# EAGLE board bolek (EAGLE 9.2.1)
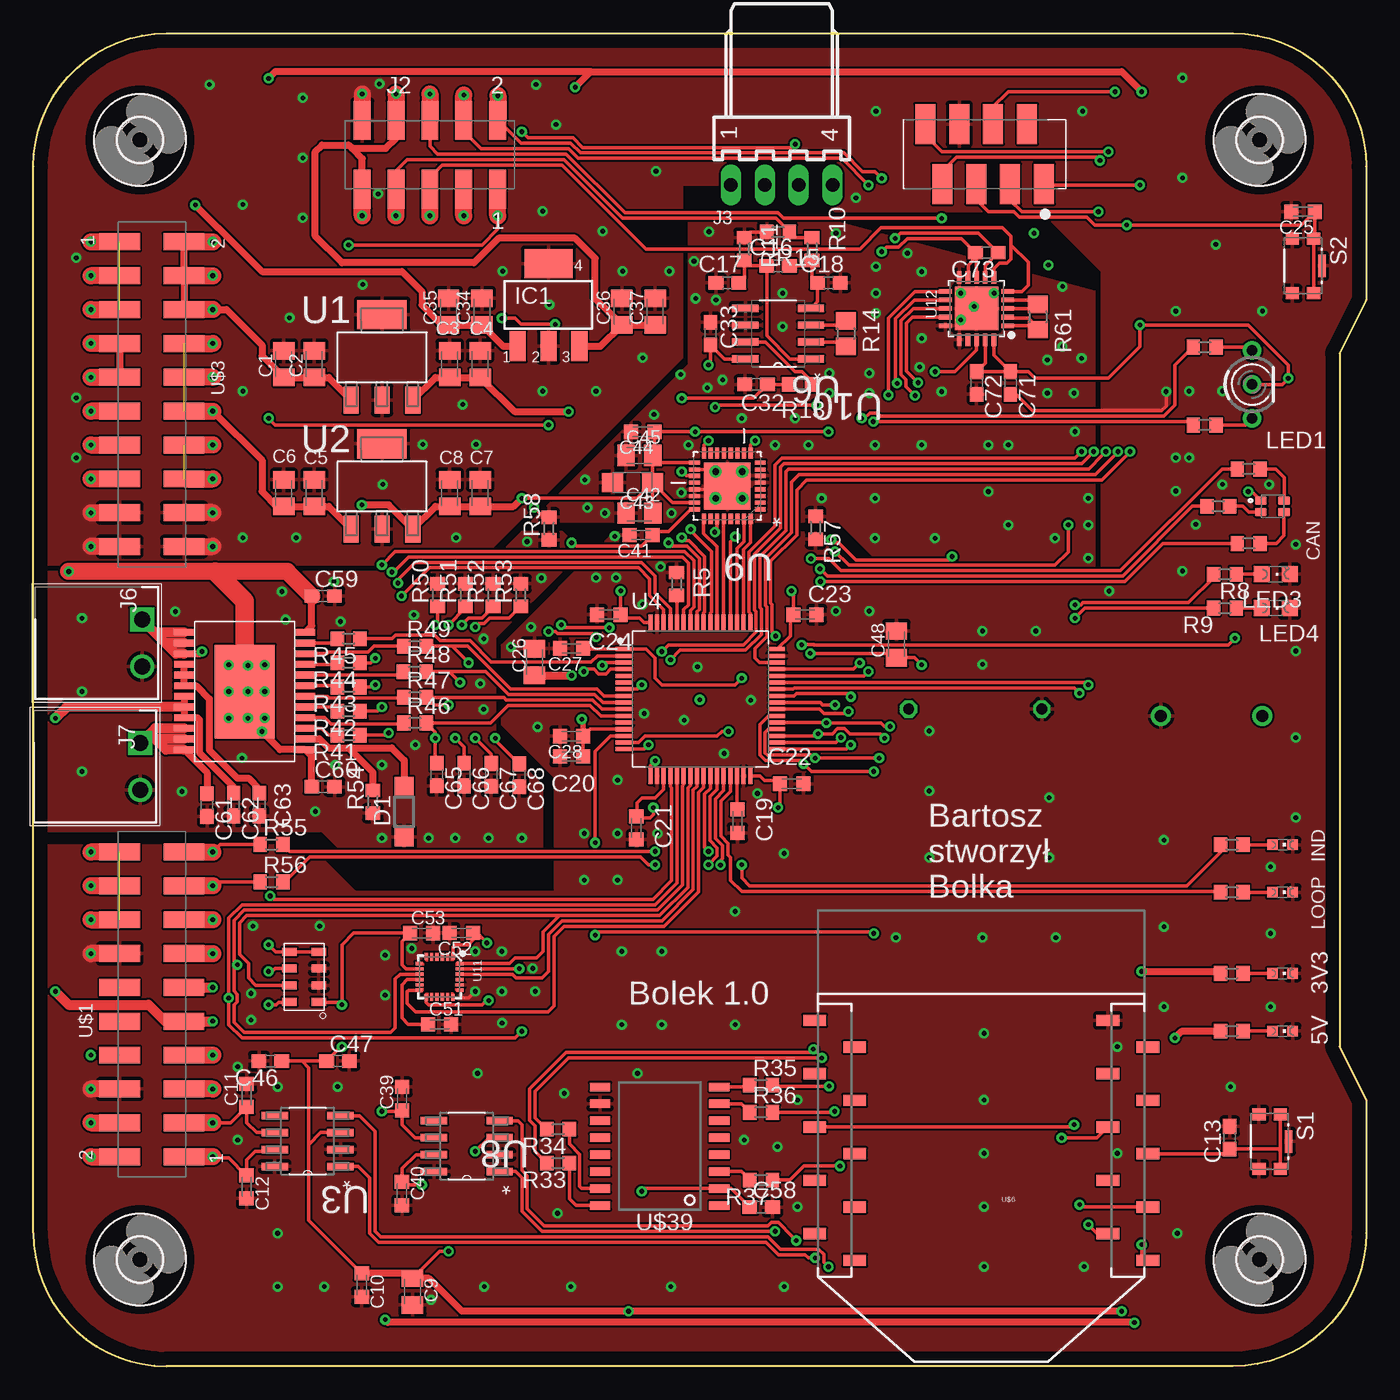
[diagram p10: board, top side]
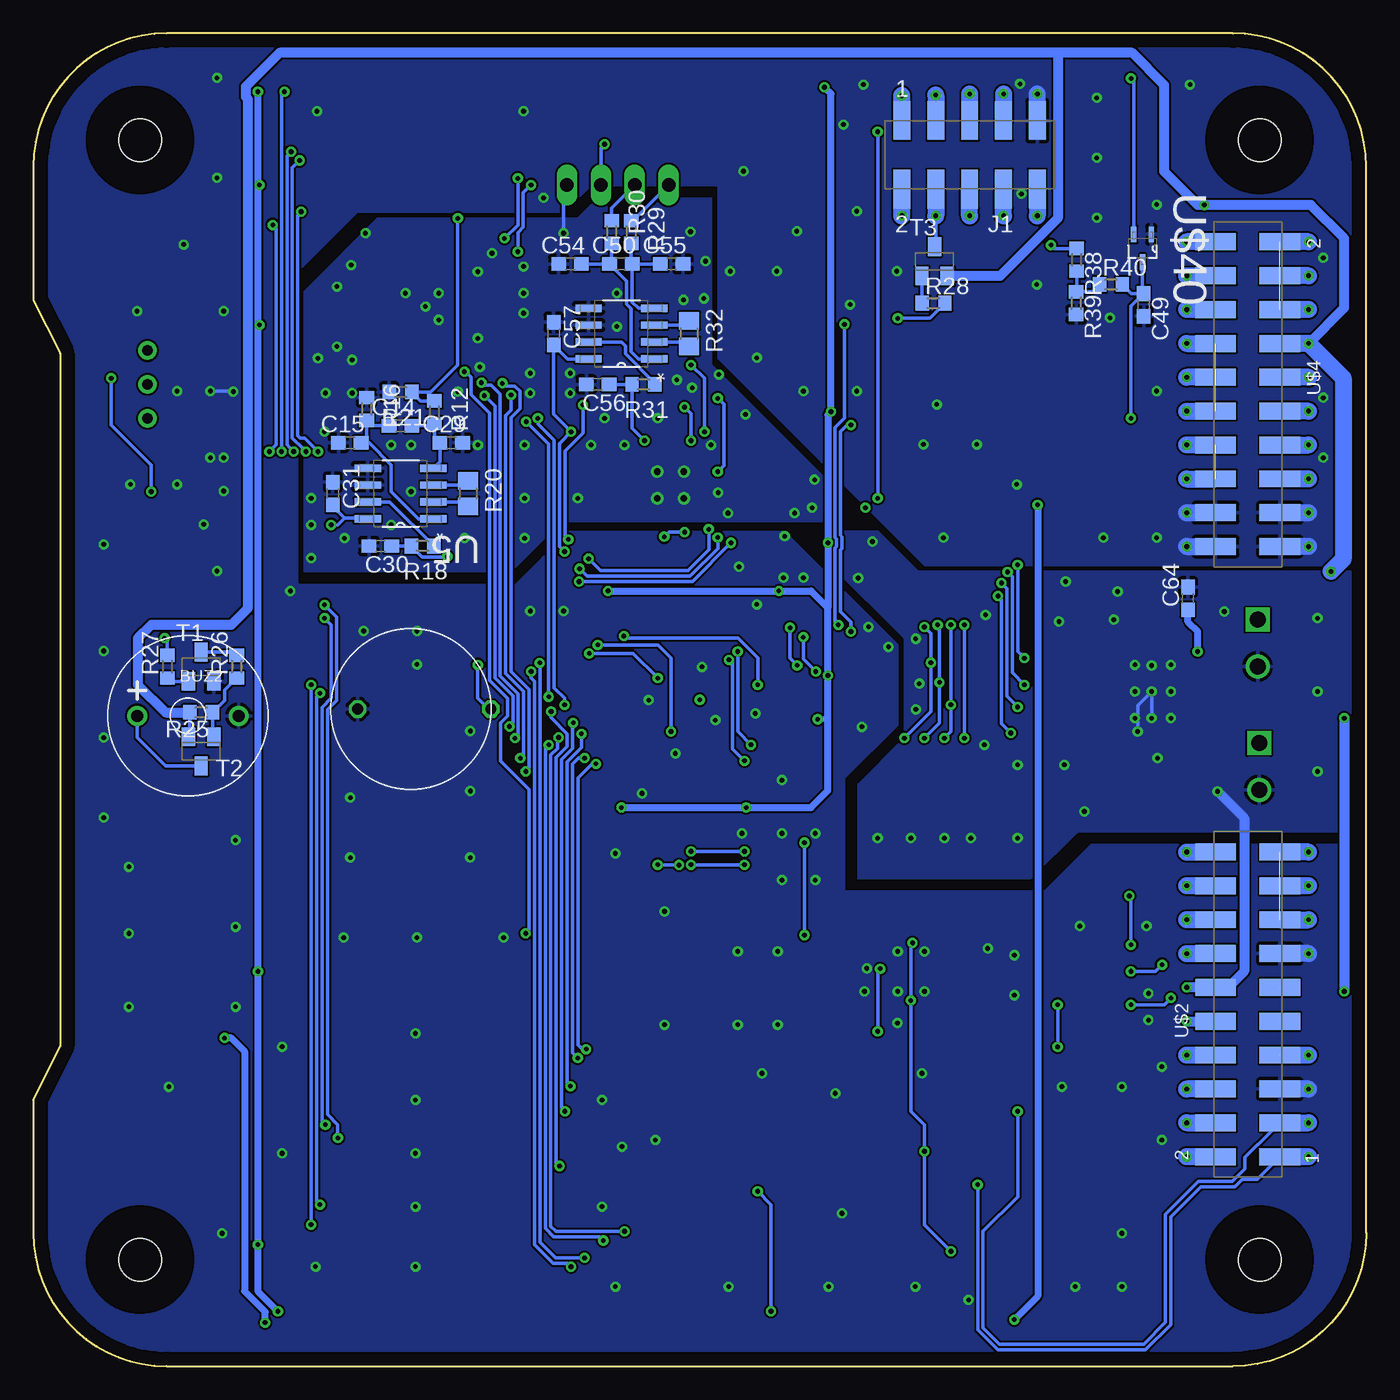
[diagram p11: board, bottom side, seen from below]

Size 100 x 100 mm. Coordinates in mm from the lower left corner, seen from the top.
Outline: 0,10 0,90 arc-90 10,100 90,100 arc-90 100,90 100,80 98,76 98,24 100,20 100,10 arc-90 90,0 10,0 arc-90 0,10
Copper layers (1*16): Top 0.035mm / dielectric 1.5mm / Bottom 0.035mm
Design rules "default": minimum track width 6mil, minimum drill 0.35mm, track to track 6mil, track to pad 6mil, pad to pad 6mil, via to via 6mil, smd to smd 6mil, copper to edge 40mil, drill to drill 6mil, minimum pad ring 10mil, minimum via ring 8mil, stop-mask expansion 4mil, vias tented up to drill 0mil, thermal gap 10mil
tRestrict: area 29.4,28.2 to 31.5,30.3

## Footprints (pad centres in the part's own frame; a part is rotated, then mirrored left to right if it is on the bottom)
CHIPLED_0603 = smd 0.8 x 0.8: A 0,-0.75; C 0,0.75
BZ2-7.6-D12.0XH6.5MM = drill 0.9 pad 1.5: + -3.8,0; - 3.8,0
C0805K = smd 1.3 x 1.6: 1 -1,0; 2 1,0
C0603K = smd 1.05 x 1.08: 1 -0.875,0; 2 0.875,0
C0603 = smd 1.1 x 1: 1 -0.85,0; 2 0.85,0
SMC_A = smd 1.6 x 1.4: + -1.5,0; - 1.5,0
SOD123 = smd 1.4 x 1.4: A 1.9,0; C -1.9,0
LEDSC160X160X070-4N = smd 0.89 x 0.64: 1 -0.87,0.425; 2 0.87,0.425; 3 0.87,-0.425; 4 -0.87,-0.425
3,2 = hole 3.2: 0,0
SOT223 = smd 1.219 x 2.235: 1 -2.311,-3.099; 2 0,-3.099; 3 2.311,-3.099 | smd 3.6 x 2.2: 4 0,3.099
SSM-105-XXX-DV = smd 1.27 x 2.921: 1 5.08,-2.572; 2 5.08,2.572; 3 2.54,-2.572; 4 2.54,2.572; 5 0,-2.572; 6 0,2.572; 7 -2.54,-2.572; 8 -2.54,2.572; 9 -5.08,-2.572; 10 -5.08,2.572
7395-04 = drill 1.016 long: 1 3.81,0; 2 1.27,0; 3 -1.27,0; 4 -3.81,0
SHDR2W100P0X350_1X2_840X920X72 = drill 1.2 pad 1.8 square: 1 0,0 | drill 1.2 pad 1.8: 2 3.5,0
DUOLED-A-3MM = drill 0.8 pad 1.4: 1 -2.54,0; 2 0,0; 3 2.54,0
CHIPLED_0805 = smd 1.2 x 1.2: A 0,-1.05; C 0,1.05
R0603 = smd 1 x 1.1: 1 -0.85,0; 2 0.85,0
R0805 = smd 1.3 x 1.5: 1 -0.95,0; 2 0.95,0
SW_KMR221GLFS = smd 0.9 x 1: 1 -2.05,0.8; 2 -2.05,-0.8; 3 2.05,-0.8; 4 2.05,0.8 | smd 1.7 x 0.55: 5 0,1.425
SOT23-BEC = smd 1 x 1.4: B -0.95,-1.1; C 0,1.1; E 0.95,-1.1
SOT230P700X180-4N = smd 2.032 x 1.143: 1 -3.2,2.311; 2 -3.2,0; 3 -3.2,-2.311 | smd 2.2 x 3.7: 4 3.2,0
SOIC127P600X175-8N = smd 1.981 x 0.559: 1 -2.464,1.905; 2 -2.464,0.635; 3 -2.464,-0.635; 4 -2.464,-1.905; 5 2.464,-1.905; 6 2.464,-0.635; 7 2.464,0.635; 8 2.464,1.905
QFP50P1290X1290X120-64 = smd 0.3 x 1.2: BOOT0 -1.75,5.75; PA3 -3.75,-5.75; PA4 -2.25,-5.75; PA5 -1.75,-5.75; PA6 -1.25,-5.75; PA7 -0.75,-5.75; PA14 3.75,5.75; PA15 3.25,5.75; PB0 0.75,-5.75; PB1 1.25,-5.75; PB2 1.75,-5.75; PB3 0.75,5.75; PB4 0.25,5.75; PB5 -0.25,5.75; PB6 -0.75,5.75; PB7 -1.25,5.75; PB8 -2.25,5.75; PB9 -2.75,5.75; PB10 2.25,-5.75; PC4 -0.25,-5.75; PC5 0.25,-5.75; PC10 2.75,5.75; PC11 2.25,5.75; PC12 1.75,5.75; PD2 1.25,5.75; VCAP_1 2.75,-5.75; VDD_1 3.75,-5.75; VDD_3 -3.75,5.75; VDD_4 -2.75,-5.75; VSS_1 3.25,-5.75; VSS_3 -3.25,5.75; VSS_4 -3.25,-5.75 | smd 1.2 x 0.3: NRST -5.75,0.75; PA0 -5.75,-2.75; PA1 -5.75,-3.25; PA2 -5.75,-3.75; PA8 5.75,0.25; PA9 5.75,0.75; PA10 5.75,1.25; PA11 5.75,1.75; PA12 5.75,2.25; PA13 5.75,2.75; PB12 5.75,-3.75; PB13 5.75,-3.25; PB14 5.75,-2.75; PB15 5.75,-2.25; PC0 -5.75,0.25; PC1 -5.75,-0.25; PC2 -5.75,-0.75; PC3 -5.75,-1.25; PC6 5.75,-1.75; PC7 5.75,-1.25; PC8 5.75,-0.75; PC9 5.75,-0.25; PC13 -5.75,3.25; PC14-OSC32_IN -5.75,2.75; PC15-OSC32_OUT -5.75,2.25; PH0-OSC_IN -5.75,1.75; PH1-OSC_OUT -5.75,1.25; VBAT -5.75,3.75; VDD_2 5.75,3.75; VSS_2 5.75,3.25; VSSA/VREF- -5.75,-1.75 | smd 1.2 x 0.328: VDDA/VREF+ -5.75,-2.25
QFN50P500X500X80-33N = smd 0.813 x 0.305: 1 -2.464,1.753; 2 -2.464,1.245; 3 -2.464,0.762; 4 -2.464,0.254; 5 -2.464,-0.254; 6 -2.464,-0.762; 7 -2.464,-1.245; 8 -2.464,-1.753; 17 2.464,-1.753; 18 2.464,-1.245; 19 2.464,-0.762; 20 2.464,-0.254; 21 2.464,0.254; 22 2.464,0.762; 23 2.464,1.245; 24 2.464,1.753 | smd 0.305 x 0.813: 9 -1.753,-2.464; 10 -1.245,-2.464; 11 -0.762,-2.464; 12 -0.254,-2.464; 13 0.254,-2.464; 14 0.762,-2.464; 15 1.245,-2.464; 16 1.753,-2.464; 25 1.753,2.464; 26 1.245,2.464; 27 0.762,2.464; 28 0.254,2.464; 29 -0.254,2.464; 30 -0.762,2.464; 31 -1.245,2.464; 32 -1.753,2.464 | smd 3.505 x 3.505: 33 0,0
MPU-9250 = smd 0.495 x 0.25: 1 -1.552,1; 6 -1.552,-1; 13 1.552,-1; 18 1.552,1 | smd 0.6 x 0.25: 2 -1.5,0.6; 3 -1.5,0.2; 4 -1.5,-0.2; 5 -1.5,-0.6; 14 1.5,-0.6; 15 1.5,-0.2; 16 1.5,0.2; 17 1.5,0.6 | smd 0.25 x 0.495: 7 -1,-1.552; 12 1,-1.552; 19 1,1.552; 24 -1,1.552 | smd 0.25 x 0.6: 8 -0.6,-1.5; 9 -0.2,-1.5; 10 0.2,-1.5; 11 0.6,-1.5; 20 0.6,1.5; 21 0.2,1.5; 22 -0.2,1.5; 23 -0.6,1.5
QFN20_4MM_0.65MM = smd 0.35 x 0.95: 1 -1.3,-2.34; 2 -0.65,-2.34; 3 0,-2.34; 4 0.65,-2.34; 5 1.3,-2.34; 11 1.3,2.34; 12 0.65,2.34; 13 0,2.34; 14 -0.65,2.34; 15 -1.3,2.34 | smd 0.95 x 0.35: 6 2.34,-1.3; 7 2.34,-0.65; 8 2.34,0; 9 2.34,0.65; 10 2.34,1.3; 16 -2.34,1.3; 17 -2.34,0.65; 18 -2.34,0; 19 -2.34,-0.65; 20 -2.34,-1.3 | smd 3.25 x 3.25: PAD 0,0
IPT1-110-01-X-D-VS = smd 1.27 x 3.048: 1 -11.43,-2.413; 2 -11.43,2.413; 3 -8.89,-2.413; 4 -8.89,2.413; 5 -6.35,-2.413; 6 -6.35,2.413; 7 -3.81,-2.413; 8 -3.81,2.413; 9 -1.27,-2.413; 10 -1.27,2.413; 11 1.27,-2.413; 12 1.27,2.413; 13 3.81,-2.413; 14 3.81,2.413; 15 6.35,-2.413; 16 6.35,2.413; 17 8.89,-2.413; 18 8.89,2.413; 19 11.43,-2.413; 20 11.43,2.413
MICROMATCH_8 = smd 1.5 x 3: 1 -5.715,2.25; 2 -4.445,-2.25; 3 -3.175,2.25; 4 -1.905,-2.25; 5 -0.635,2.25; 6 0.635,-2.25; 7 1.905,2.25; 8 3.175,-2.25
XBEE-SMD = smd 1.7 x 0.85: 1 -12.5,20; 2 -9.5,18; 3 -12.5,16; 4 -9.5,14; 5 -12.5,12; 6 -9.5,10; 7 -12.5,8; 8 -9.5,6; 9 -12.5,4; 10 -9.5,2; 11 12.5,2; 12 9.5,4; 13 12.5,6; 14 9.5,8; 15 12.5,10; 16 9.5,12; 17 12.5,14; 18 9.5,16; 19 12.5,18; 20 9.5,20
MS56XX = smd 1.1 x 0.6: P$1 -1.1,1.875; P$2 -1.1,0.625; P$3 -1.1,-0.625; P$4 -1.1,-1.875; P$5 1.1,-1.875; P$6 1.1,-0.625; P$7 1.1,0.625; P$8 1.1,1.875
CR1220_POZ = drill 0.8 octagon: + 6,0; GND -4,0
SOIC16 = smd 0.635 x 1.524: 1 -4.445,-4.469; 2 -3.175,-4.469; 3 -1.905,-4.469; 4 -0.635,-4.469; 5 0.635,-4.469; 6 1.905,-4.469; 7 3.175,-4.469; 8 4.445,-4.469; 9 4.445,4.469; 10 3.175,4.469; 11 1.905,4.469; 12 0.635,4.469; 13 -0.635,4.469; 14 -1.905,4.469; 15 -3.175,4.469; 16 -4.445,4.469
SOT65P210X110-3N = smd 1.168 x 0.406: 1 -1.041,0.66; 2 -1.041,-0.66; 3 1.041,0
POWERSSO-24 = smd 1.5 x 0.5: P$1 -0.8,9.6; P$2 -0.8,8.8; P$3 -0.8,8; P$4 -0.8,7.2; P$5 -0.8,6.4; P$6 -0.8,5.6; P$7 -0.8,4.8; P$8 -0.8,4; P$9 -0.8,3.2; P$10 -0.8,2.4; P$11 -0.8,1.6; P$12 -0.8,0.8; P$13 8.3,9.6; P$14 8.3,8.8; P$15 8.3,8; P$16 8.3,7.2; P$17 8.3,6.4; P$18 8.3,5.6; P$19 8.3,4.8; P$20 8.3,4; P$21 8.3,3.2; P$22 8.3,2.4; P$23 8.3,1.6; P$24 8.3,0.8 | smd 4.5 x 7: P$25 3.733,5.253

## Placement (x,y rotation side)
3V3  [CHIPLED_0603]  93.73,29.46 270 top
5V  [CHIPLED_0603]  93.73,25.15 270 top
BUZ2  KS-12065D03YA  [BZ2-7.6-D12.0XH6.5MM]  88.41,48.8 0 bottom
C1  10u  [C0805K]  18.8,75.18 90 top
C2  [C0805K]  21.08,75.18 90 top
C3  10u  [C0805K]  31.24,75.18 90 top
C4  2u2  [C0805K]  33.53,75.18 90 top
C5  10u  [C0805K]  21.08,65.5 90 top
C6  [C0805K]  18.8,65.5 90 top
C7  10u  [C0805K]  33.53,65.5 90 top
C8  2u2  [C0805K]  31.24,65.5 90 top
C9  10u  [C0805K]  28.45,5.59 270 top
C10  100n  [C0603K]  24.64,6.1 270 top
C11  100p  [C0603K]  16,20.32 90 top
C12  100p  [C0603K]  16,13.45 270 top
C13  100nf  [C0603]  89.76,17.14 90 top
C14  10nf  [C0603]  72.45,70.55 0 bottom
C15  1nf  [C0603]  76.26,69.28 0 bottom
C16  10nf  [C0603]  55.88,82.55 0 top
C17  1nf  [C0603]  52.07,81.28 0 top
C18  1nf  [C0603]  59.69,81.28 0 top
C19  2.2uF  [C0603K]  52.83,40.89 270 top
C20  100nF  [C0603K]  40.39,45.74 180 top
C21  100nF  [C0603K]  45.24,40.39 270 top
C22  100nF  [C0603K]  56.9,43.69 0 top
C23  100nF  [C0603K]  57.9,56.39 0 top
C24  100nF  [C0603K]  43.18,56.39 180 top
C25  100nF  [C0603K]  95.25,86.61 180 top
C26  10uF  [C0805K]  37.59,52.83 90 top
C27  100nF  [C0603K]  40.39,53.85 180 top
C28  1u  [C0603K]  40.39,47.27 180 top
C29  1nf  [C0603]  68.64,69.28 0 bottom
C30  10nf  [C0603]  73.97,61.53 180 bottom
C31  0.1uf  [C0603]  77.53,65.47 270 bottom
C32  10nf  [C0603]  54.23,73.66 180 top
C33  0.1uf  [C0603]  50.8,77.47 270 top
C34  10u  [C0805K]  33.65,79.12 90 top
C35  [C0805K]  31.15,79.12 90 top
C36  10u  [C0805K]  44.15,79.12 90 top
C37  2u2  [C0805K]  46.65,79.12 90 top
C39  100p  [C0603K]  27.67,20.07 90 top
C40  100p  [C0603K]  27.66,12.95 270 top
C41  100nf  [C0603K]  45.59,62.36 180 top
C42  10u  [C0805K]  45.47,64.01 0 top
C43  [SMC_A]  44.96,66.29 180 top
C44  100nf  [C0603K]  45.72,70.1 180 top
C45  10u  [C0805K]  45.47,68.33 0 top
C46  [C0603]  17.78,22.9 180 top
C47  [C0603]  22.86,22.9 0 top
C48  100nf  [C0805K]  64.76,54.15 90 top
C49  100nf  [C0603]  16.7,79.62 270 bottom
C50  10nf  [C0603]  55.92,82.69 0 bottom
C51  H100n  [C0603K]  30.48,25.65 0 top
C52  H10n  [C0603K]  32.12,32.5 180 top
C53  H100n  [C0603K]  29.13,32.49 0 top
C54  1nf  [C0603]  59.73,82.69 0 bottom
C55  1nf  [C0603]  52.11,82.69 0 bottom
C56  10nf  [C0603]  57.66,73.66 180 bottom
C57  0.1uf  [C0603]  60.96,77.47 270 bottom
C58  100nf  [C0603]  54.61,11.93 0 top
C59  100nf  [C0603]  21.74,57.78 0 top
C60  100nf  [C0603]  21.74,43.47 0 top
C61  10nf  [C0603]  13.03,42.1 270 top
C62  10nf  [C0603]  15.03,42.13 270 top
C63  10nf  [C0603]  16.95,42.13 270 top
C64  10nf  [C0603]  13.37,57.61 90 bottom
C65  10nf  [C0603]  30.27,44.39 270 top
C66  10nf  [C0603]  32.32,44.38 270 top
C67  10nf  [C0603]  34.35,44.37 270 top
C68  10nf  [C0603]  36.45,44.34 270 top
C71  0.1uf  [C0603]  73.31,73.77 270 top
C72  0.1uf  [C0603]  70.77,73.77 270 top
C73  10nf  [C0603]  71.53,83.55 180 top
D1  [SOD123]  27.82,41.61 90 top
D2  APTF1616LSEEZGKQBKC  [LEDSC160X160X070-4N]  92.96,64.52 0 top
H1  MOUNT-HOLE3.2  [3,2]  8,92 0 top
H2  MOUNT-HOLE3.2  [3,2]  8,8 0 top
H3  MOUNT-HOLE3.2  [3,2]  92,8 0 top
H4  MOUNT-HOLE3.2  [3,2]  92,92 0 top
IC1  TLE4266GSV10  [SOT223]  38.65,79.62 0 top
IND  [CHIPLED_0603]  93.73,39.12 270 top
J1  SSM-105-XXX-DV  [SSM-105-XXX-DV]  29.75,90.89 180 bottom
J2  SSM-105-XXX-DV  [SSM-105-XXX-DV]  29.75,90.89 0 top
J3  22-05-7048-04  [7395-04]  56.15,88.62 180 top
J6  1844210  [SHDR2W100P0X350_1X2_840X920X72]  8.15,56 270 top
J7  1844210  [SHDR2W100P0X350_1X2_840X920X72]  8.02,46.75 270 top
LED1  L-115WEGW-CA  [DUOLED-A-3MM]  91.44,73.66 270 top
LED3  LEDCHIPLED_0805  [CHIPLED_0805]  93.21,59.42 270 top
LED4  LEDCHIPLED_0805  [CHIPLED_0805]  93.21,56.88 270 top
LOOP  [CHIPLED_0603]  93.73,35.56 270 top
R1  [R0603]  89.92,29.46 0 top
R2  [R0603]  89.92,25.15 0 top
R3  [R0603]  89.92,35.56 0 top
R4  470  [R0603]  87.88,70.61 180 top
R5  [R0603]  48.26,58.69 270 top
R6  470  [R0603]  87.88,76.45 180 top
R7  [R0603]  89.92,39.12 0 top
R8  470  [R0603]  89.4,59.42 180 top
R9  470  [R0603]  89.4,56.88 0 top
R10  4.02k  [R0603]  58.42,83.82 270 top
R11  4.02k  [R0603]  53.34,83.82 270 top
R12  4.02k  [R0603]  69.91,71.57 270 bottom
R13  4.02k  [R0603]  57.53,73.66 180 top
R14  0  [R0805]  60.96,77.47 270 top
R15  10  [R0603]  55.88,85.09 180 top
R16  4.02k  [R0603]  74.99,71.82 270 bottom
R18  4.02k  [R0603]  70.8,61.53 180 bottom
R20  0  [R0805]  67.37,65.47 270 bottom
R21  10  [R0603]  72.45,73.09 180 bottom
R25  10k  [R0603]  87.41,49.05 180 bottom
R26  10k  [R0603]  84.74,52.48 90 bottom
R27  10k  [R0603]  89.95,52.48 90 bottom
R28  10k  [R0603]  32.45,79.76 0 bottom
R29  4.02k  [R0603]  55.15,85.09 270 bottom
R30  4.02k  [R0603]  56.61,85.09 270 bottom
R31  4.02k  [R0603]  54.23,73.66 180 bottom
R32  0  [R0805]  50.8,77.47 270 bottom
R33  10  [R0603]  39.37,15.24 180 top
R34  10  [R0603]  39.37,17.78 180 top
R35  10  [R0603]  54.61,21.09 0 top
R36  10  [R0603]  54.61,19.05 0 top
R37  10  [R0603]  54.61,13.97 180 top
R38  100k  [R0603]  21.72,83 270 bottom
R39  10k  [R0603]  21.76,79.76 270 bottom
R40  10k  [R0603]  19.15,81.15 0 bottom
R41  10k  [R0603]  23.66,47.34 180 top
R42  10k  [R0603]  23.66,49.15 180 top
R43  10k  [R0603]  23.66,50.96 180 top
R44  10k  [R0603]  23.66,52.77 180 top
R45  10k  [R0603]  23.66,54.58 180 top
R46  10k  [R0603]  28.64,48.26 0 top
R47  10k  [R0603]  28.64,50.18 0 top
R48  10k  [R0603]  28.62,52.11 0 top
R49  10k  [R0603]  28.64,54.02 0 top
R50  1k  [R0603]  30.33,57.86 90 top
R51  1k  [R0603]  32.41,57.86 90 top
R52  1k  [R0603]  34.49,57.86 90 top
R53  1k  [R0603]  36.57,57.86 90 top
R54  1k  [R0603]  25.47,42.34 90 top
R55  1k  [R0603]  17.87,39.14 0 top
R56  1k  [R0603]  17.87,36.33 0 top
R57  0  [R0603]  58.69,62.9 270 top
R58  0  [R0603]  38.69,62.84 90 top
R61  [R0805]  75.37,78.72 270 top
R106  470  [R0603]  91.19,67.31 180 top
R107  470  [R0603]  91.19,61.72 180 top
R108  470  [R0603]  88.9,64.52 180 top
S1  KMR221GLFS  [SW_KMR221GLFS]  92.76,16.86 270 top
S2  KMR221GLFS  [SW_KMR221GLFS]  95.25,82.55 270 top
T1  [SOT23-BEC]  87.41,52.48 0 bottom
T2  [SOT23-BEC]  87.41,46.13 180 bottom
T3  [SOT23-BEC]  32.38,82.89 0 bottom
U1  MCP1826S-5002E/DB  [SOT230P700X180-4N]  26.16,75.69 90 top
U2  MCP1826S-5002E/DB  [SOT230P700X180-4N]  26.16,66.01 90 top
U3  SN65HVD230DR  [SOIC127P600X175-8N]  20.57,16.89 180 top
U4  STM32F446RCT6LQFP64  [QFP50P1290X1290X120-64]  50.04,50.04 0 top
U5  AD8227BRZ-R7  [SOIC127P600X175-8N]  72.45,65.47 180 bottom
U6  AD8227BRZ-R7  [SOIC127P600X175-8N]  55.88,77.47 180 top
U8  SN65HVD230DR  [SOIC127P600X175-8N]  32.52,16.51 180 top
U9  AD7194BCPZ  [QFN50P500X500X80-33N]  52.07,66.04 180 top
U10  AD8227BRZ-R7  [SOIC127P600X175-8N]  55.88,77.47 180 bottom
U11  MPU-9250  [MPU-9250]  30.48,29.21 270 top
U12  MAX31865  [QFN20_4MM_0.65MM]  70.77,79.35 90 top
U$1  IPT1-110-01-X-D-VS  [IPT1-110-01-X-D-VS]  8.89,27.15 90 top
U$2  IPT1-110-01-X-D-VS  [IPT1-110-01-X-D-VS]  8.89,27.15 90 bottom
U$3  IPT1-110-01-X-D-VS  [IPT1-110-01-X-D-VS]  8.89,72.92 270 top
U$4  IPT1-110-01-X-D-VS  [IPT1-110-01-X-D-VS]  8.89,72.92 270 bottom
U$5  MICROMATCH_8  [MICROMATCH_8]  70.1,90.93 180 top
U$6  XBEE-1B3  [XBEE-SMD]  71.12,27.94 180 top
U$31  MS56XX  [MS56XX]  20.32,29.21 180 top
U$32  CR1220_POZ  [CR1220_POZ]  71.67,49.3 0 bottom
U$39  S25FLX  [SOIC16]  46.99,16.51 90 top
U$40  BAS40W-04  [SOT65P210X110-3N]  16.78,83.87 270 bottom
VNQ5027AK-E1  VNQ5027AK-E  [POWERSSO-24]  19.6,55.86 180 top

## Tracks (layer width: path | path; a pad name or v marks a point on that pad's centre or on a via)
3V8  (via drill 0.35)
  Top 0.508: v13.46,79.27 14.5,79.27 17.15,76.62 17.15,75.81 17.83,75.13 17.85,75.13 C1.1 C2.1 22.16,74.18 U1.1 | U$4.1 U$4.3 U$4.5
  Top 1.27: U$4.1 v13.46,84.35 | U$4.3 v13.46,81.81 | v13.46,79.27 U$4.5
  Bottom 1.27: U$4.1 v13.46,84.35 | v13.46,81.81 U$4.3 | U$4.5 v13.46,79.27
5V5  (via drill 0.35)  (2 unrouted)
  Top 0.508: v13.46,71.65 17.15,67.97 17.15,65.62 18.27,64.5 C6.1 C5.1 22.16,64.5 U2.1
  Top 1.27: U$4.7 v13.46,76.73 | v13.46,74.19 U$4.9 | U$4.11 v13.46,71.65
  Bottom 1.27: v13.46,76.73 U$4.7 | U$4.9 v13.46,74.19 | v13.46,71.65 U$4.11
6V6  (via drill 0.35)  (1 unrouted)
  Top 1.27: v13.46,69.11 U$4.13 | U$4.15 v13.46,66.57
  Bottom 1.27: U$4.13 v13.46,69.11 | v13.46,66.57 U$4.15
7V4  (via drill 0.35)  (2 unrouted)
  Top 1.27: v4.32,84.35 U$3.1 | U$3.3 v4.32,81.81 | v4.32,79.27 U$3.5
  Bottom 1.27: v4.32,84.35 U$3.1 | v4.32,81.81 U$3.3 | v4.32,79.27 U$3.5
+3V3  (via drill 0.35)
  Top 0.152: 53.8,44.28 U4.VDD_1
  Top 0.254: U4.VDD_2 56.79,54.79 56.79,56.15 C23.1 57.02,58.02 v56.88,58.17 | U4.VDD_3 45.81,55.79 45.47,56.13 44.31,56.13 C24.1 44.05,58.15 v44.07,58.17 | U4.VDD_1 54.52,44.29 54.86,43.94 55.77,43.94 C22.1 56.02,42.05 v55.88,41.91 | C20.1 C28.1 41.78,47.79 U4.VDDA/VREF+ | v46.51,41.91 46.51,41.4 46.26,41.15 45.36,41.15 C21.1 45.29,41.3 45.29,42.26 45.65,42.62 46.65,42.62 47.29,43.26 U4.VDD_4 | v40.39,61.78 40.49,61.78 40.74,61.53 45.64,61.53 C41.1 46.73,62.62 47.65,62.62 49.32,64.29 U9.24 | C46.1 20.15,22.9 | 20.15,22.9 C47.1 23.07,23.96 v23.15,23.96 | U$31.P$1 21.45,27.3 22.97,27.3 v23.15,27.12 23.15,31.62 24.02,32.49 C53.1 27.65,31.89 27.65,30.12 27.95,29.82 U11.8 | U11.13 29.48,27.29 29.65,27.12 33.65,27.12 33.96,27.43 v34.16,27.43 | C58.1 52.35,13.34 U$39.2 45.87,13.34 v45.65,13.12 | C10.1 20.65,10.96 20.65,16.62 | 20.65,16.62 21.56,17.53 U3.3 | 20.15,22.9 20.65,22.4 20.65,16.62 | C9.1 30.48,8.62 v31.15,8.62 | v33.15,16.12 34.17,17.14 U8.3 | v83.03,88.62 75.88,88.62 U$5.1 | v83.15,9.12 83.15,8.41 U$6.1 | LED1.2 93.69,73.66 v94.15,74.12 94.15,75.12 91.15,78.12 v83.03,78.12 83.03,76.5 80.65,74.12 75.15,74.12 74.65,74.62 C71.1 | D2.1 91.42,65.62 v91.15,65.62 | v34.04,31.76 33.29,32.5 C52.1 33,31.97 32.65,31.62 31.65,31.62 31.48,31.45 U11.1 | U12.19 71.42,75.27 C72.1 C71.1 | C71.1 72.07,75.86 U12.20
  Top 0.406: C28.1 41.26,48.42 v41.15,48.54
  Top 0.508: U1.3 30.17,74.18 C3.1 C4.1 36.09,71.62 v40.15,71.62 | v40.65,95.96 41.81,97.12 | v83.15,95.62 81.65,97.12 41.81,97.12 | v81.65,4.12 v44.65,4.12 32.15,4.12 29.68,6.59 C9.1 28.06,6.97 C10.1 | 41.81,97.12 18.15,97.12 v17.65,96.62 | v83.15,29.62 88.91,29.62 R1.1
  Top 0.61: C26.1 40.37,51.83 v40.39,51.82
  Bottom 0.254: v23.15,23.96 v23.15,27.12 | v34.04,31.76 34.16,31.63 v34.16,27.43 34.16,19.13 33.15,18.12 v33.15,16.12 33.15,10.62 v31.15,8.62 | v17.65,96.62 17.44,96.41 U$40.2 | 83.15,88.62 v83.03,88.62 | v44.65,4.12 44.65,12.12 v45.65,13.12 | 83.15,78.62 83.15,78.24 v83.03,78.12 | v91.15,65.62 91.15,67.62 94.15,70.62 v94.15,74.12
  Bottom 0.406: v41.15,48.54 40.39,48.54
  Bottom 0.508: v56.88,58.17 v44.07,58.17 41.66,58.17 40.39,56.9 | v55.88,41.91 v46.51,41.91 41.66,41.91 40.39,43.18 40.39,48.54 v40.39,51.82 40.39,56.9 | 40.39,56.9 v40.39,61.78 40.39,71.38 v40.15,71.62 40.15,95.46 v40.65,95.96 | v81.65,4.12 83.15,5.62 v83.15,9.12 v83.15,29.62 83.15,78.62 83.15,88.62 v83.15,95.62
+5V  (via drill 0.35)
  Top 0.254: v36.65,65.12 45.28,65.12 C43.+ | C45.2 46.59,68.45 C44.1 v49.65,70.1 v59.65,70.1 | C45.2 46.47,66.3 C43.+ | C43.+ C42.2 | C45.2 47,67.79 U9.17 | C43.+ 47.96,64.8 U9.23 | v50.65,75.12 50.8,75.27 C33.2 51.85,75.56 U6.8 | v36.65,92.62 37.12,92.15 40.49,92.15 41.21,91.43 56.9,91.43 v57.15,91.68 | v60.15,61.12 61.18,60.09 76.65,60.09 77.65,61.09 v77.65,63.12
  Top 0.508: v36.65,65.12 36.03,64.5 C7.1 C8.1 30.17,64.5 U2.3 26.66,64.62 v24.65,64.62 | v26.4,3.49 26.61,3.29 82.59,3.29 v82.6,3.27 | v85.65,24.62 86.18,25.15 R2.1
  Bottom 0.254: v36.65,65.12 v36.65,92.62 | v49.65,70.1 49.65,74.12 v50.65,75.12 | U10.8 59.9,75.56 C57.2 60.96,71.41 v59.65,70.1 60.52,69.23 60.52,61.49 v60.15,61.12 | v57.15,91.68 57.42,91.41 J3.3 | U5.8 74.97,63.62 76.65,63.62 | 76.65,63.62 77.53,64.5 C31.2 | v77.65,63.12 77.15,63.12 76.65,63.62
  Bottom 0.508: v24.65,64.62 24.65,5.25 v26.4,3.49 | v82.6,3.27 82.6,4.07 84.15,5.62 84.15,23.62 85.15,24.62 v85.65,24.62
ADC_CS
  Top 0.254: U4.PA15 53.29,61.26 53.82,61.79 U9.32
ADC_MISO  (via drill 0.35)
  Top 0.254: U9.27 51.31,62.75 v51.13,62.58 | v52.66,62.23 52.29,61.85 U4.PC11
  Bottom 0.254: v51.13,62.58 52.32,62.58 v52.66,62.23
ADC_MOSI
  Top 0.254: U4.PC12 51.79,63.55 U9.28
ADC_POWER1_CURRENT  (via drill 0.35)
  Top 0.254: U4.PC3 42.58,48.79 41.79,49.58 35.61,49.58 34.29,48.26 R46.2 30.15,47.6 v30.15,47.12 30.15,45.36 C65.1 | v30.15,55.62 30.33,55.8 R50.1
  Bottom 0.254: v30.15,47.12 v30.15,55.62
ADC_POWER2_CURRENT  (via drill 0.35)
  Top 0.254: U4.PC2 42.65,49.29 41.95,49.99 35.48,49.99 35.3,50.16 29.51,50.16 R47.2 30.05,49.62 v31.15,49.62 | v31.65,47.12 32.32,46.45 C66.1 | v31.15,55.62 32.41,56.88 R51.1
  Bottom 0.254: v31.65,47.12 31.15,47.62 v31.15,49.62 v31.15,55.62
ADC_POWER3_CURRENT  (via drill 0.35)
  Top 0.254: U4.PC1 42.73,49.79 42.12,50.39 35.65,50.39 33.92,52.12 29.49,52.12 R48.2 31.2,52.11 v32,51.31 | v33.15,47.12 34.35,45.91 C67.1 | v32.15,55.62 32.65,56.12 33.65,56.12 34.49,56.96 R52.1
  Bottom 0.254: v33.15,47.12 32,48.27 v32,51.31 32,55.47 v32.15,55.62
ADC_POWER4_CURRENT  (via drill 0.35)
  Top 0.254: U4.PC0 42.8,50.29 42.29,50.8 35.81,50.8 32.59,54.02 R49.2 31.42,54.02 v32.66,52.78 | C68.1 34.65,46.99 v34.65,47.12 | v33.15,55.46 33.4,55.71 33.82,55.71 34.23,56.12 35.68,56.12 R53.1
  Bottom 0.254: v34.65,47.12 32.66,49.11 v32.66,52.78 32.66,54.97 v33.15,55.46
ADC_SCLK
  Top 0.254: U4.PC10 52.79,61.33 53.32,61.87 53.32,63.57 U9.31
ADC_SYNC
  Top 0.254: U4.PD2 51.29,61.49 50.29,62.48 50.29,63.55 U9.25
AGND  (via drill 0.35, 0.5)
  Top 0.254: U9.18 50.48,67.28 50.65,67.12 50.65,66.12 | 50.65,66.12 50.42,65.89 50.42,65.79 U9.21 | U9.33 50.73,66.04 50.65,66.12 | U12.PAD 70.73,79.35 v70.58,79.5 | R58.2 38.28,63.69 v37.57,64.4 | R15.2 53.76,85.09 R11.1
  Bottom 0.254: v60.22,85 60.22,88.36 J3.4
  other vias: 59.15,65.12 78.15,70.12 66.65,69.12 63.15,69.12 58.15,69.12 55.65,69.12 49.15,69.12 53.15,71.12 57.15,71.12 47.88,64.01 48.62,65.55 42.88,64.01 41.38,66.51 41.57,64.4 50.57,73.4 46.57,71.4 48.57,74.4 49.57,82.9 51.19,67.11 49.69,80.11 50.69,85.11 51.22,80 56.22,78 56.22,80.5 75.08,85 63.22,82.5 63.22,80.5 63.22,79 62.72,74.5 62.72,73 59.72,73 59.72,74.5 51.72,74 76.08,73 69.58,78.5 69.58,80.5 65.58,83.5 77.22,81 77.22,76.5 53.19,67.11 51.19,65.11 53.19,65.11 63.15,65.12 79.15,65.12 63.15,62.12 79.15,60.62 76.15,82.62 66.5,74.97 72.08,80.5 76.08,75.5 78.08,73 71.65,69.12 73.15,69.12 71.65,65.62 67.65,62.12 76.65,62.12 78.65,75.62 73.15,63.12 79.15,63.12 68.15,73.12 66.65,77.12 66.65,82.12
  pour Top: 37.4,63.37 60.4,63.37 64.15,59.62 79.65,59.62 79.65,80.62 59.15,86.12 57.65,87.62 49.15,87.62 49.15,75.13
  pour Bottom: 37.4,63.37 60.4,63.37 64.15,59.62 79.65,59.62 79.65,80.62 74.15,86.12 59.15,86.12 57.65,87.62 49.15,87.62 49.15,75.13
BACKUP_SUPPLY  (via drill 0.35)  (2 unrouted)
  Top 1.27: v4.32,33.5 U$2.15 | U$2.17 v4.32,36.04 | U$2.19 v4.32,38.58
  Bottom 1.27: U$2.15 v4.32,33.5 | v4.32,36.04 U$2.17 | v4.32,38.58 U$2.19
BURNOUT_PIN_IN  (via drill 0.35)
  Top 0.254: v17.65,71.12 18.15,70.62 v38.65,70.62 | v38.65,55.12 39.17,55.12 39.33,54.96 41.96,54.96 v42.23,54.7 | v41.3,52.12 41.46,52.29 42.05,52.29 42.41,51.92 42.96,51.92 43.32,52.29 U4.PC15-OSC32_OUT
  Bottom 0.254: C49.1 16.78,80.55 U$40.3 | R40.2 17.62,80.47 C49.1 | C49.1 17.65,79.52 v17.65,71.12 | v38.65,70.62 38.95,70.62 39.45,70.12 39.45,62.34 39.32,62.22 39.32,61.34 39.45,61.21 39.45,56.62 38.65,55.82 v38.65,55.12 | v42.23,54.7 42.23,53.05 v41.3,52.12
BURNOUT_PIN_OUT  (via drill 0.35)
  Top 0.254: v39.6,55.62 39.81,55.41 v43.22,55.41 | v42.69,52.58 42.89,52.79 U4.PC14-OSC32_IN | v39.15,78.17 36.6,78.17 36.15,78.62 v35.15,78.62
  Bottom 0.254: v39.6,55.62 39.85,55.87 39.85,61.38 39.73,61.5 39.73,62.05 39.85,62.17 39.85,70.42 39.15,71.12 v39.15,78.17 | v43.22,55.41 43.22,53.11 v42.69,52.58 | v35.15,78.62 32.74,78.62 R28.2
BUZZER  (via drill 0.35)
  Top 0.254: U4.PA1 45.39,46.79 45.88,47.28 51.31,47.28 51.65,47.62 v52.15,47.62 | v90.15,54.62 89.65,54.12 58.58,54.12 58.57,54.13 58.02,54.13 58.01,54.12 v57.65,54.12
  Bottom 0.254: v52.15,47.62 52.15,53.12 53.15,54.12 v57.65,54.12 | v90.15,54.62 89.95,54.42 R27.2
CAN2_RX  (via drill 0.35)
  Top 0.254: U4.PB12 61,46.29 v61.34,46.62 | v57.24,9.42 56.52,10.15 56.52,10.16 56.31,10.37 56.31,10.39 55.92,10.78 55.38,10.78 55.13,10.53 38.32,10.53 37.06,11.79 37.06,14.29 36.65,14.7 36.65,18.12 36.35,18.41 U8.4
  Bottom 0.254: v61.34,46.62 61.59,46.37 61.59,10.34 60.96,9.71 57.53,9.71 v57.24,9.42
CAN2_TX  (via drill 0.35)
  Top 0.254: U4.PB13 60.22,46.79 v60.6,47.17 | v55.65,10.12 38.15,10.12 36.65,11.62 36.65,14.12 36.16,14.61 U8.1
  Bottom 0.254: v60.6,47.17 60.68,47.09 60.68,46.35 61.18,45.84 61.18,10.51 60.79,10.12 v55.65,10.12
CAN_RX  (via drill 0.35)
  Top 0.254: U4.PA11 62.32,51.79 v62.65,52.12 | v59.65,7.46 59.31,7.8 59.31,8.39 58.92,8.78 57.52,8.78 57.51,8.77 56.07,8.77 55.13,9.71 26.06,9.71 25.65,10.12 25.65,17.62 24.47,18.8 U3.4
  Bottom 0.254: v62.65,52.12 62.65,51.62 62.4,51.37 62.4,9.11 61,7.71 59.9,7.71 v59.65,7.46
CAN_TX  (via drill 0.35)
  Top 0.254: U4.PA12 61.53,52.29 v62.01,52.76 | v58.65,8.12 58.15,8.12 57.9,8.37 57.69,8.37 57.68,8.36 55.91,8.36 54.96,9.31 25.89,9.31 25.24,9.95 25.24,14.12 24.38,14.99 U3.1
  Bottom 0.254: v62.01,52.76 62.01,52.41 61.99,52.39 61.99,9.28 60.84,8.12 v58.65,8.12
CANH  (via drill 0.35)
  Top 0.254: U3.7 17.97,16.12 16.65,16.12 16,15.47 C12.1 15.94,14.33 14.65,15.62 13.56,15.62 v13.46,15.72
  Top 1.27: v13.46,15.72 U$2.2
  Bottom 1.27: U$2.2 v13.46,15.72
CANH2  (via drill 0.35)
  Top 0.254: U8.7 28.7,15.88 27.66,14.84 C40.1 27.87,13.62 v29.15,13.62
  Top 1.27: v4.32,15.72 U$2.1
  Bottom 0.254: v29.15,13.62 29.15,2.72 27.65,1.22 16.55,1.22 14.65,3.12 14.65,11.22 12.41,13.46 9.86,13.46 9.29,14.03 8.17,14.03 U$2.1
  Bottom 1.27: v4.32,15.72 U$2.1
CANL  (via drill 0.35)
  Top 0.254: U$2.4 14.82,18.26 C11.1 16,18.27 16.74,17.53 U3.6
  Top 1.27: v13.46,18.26 U$2.4
  Bottom 1.27: v13.46,18.26 U$2.4
CANL2  (via drill 0.35)
  Top 0.254: U8.6 28.67,17.14 28.65,17.12 27.67,18.1 C39.1 27.6,19.12 v26.15,19.12
  Top 1.27: v4.32,18.26 U$2.3
  Bottom 0.254: U$2.3 8.1,16.63 8.12,16.63 9.09,15.66 9.09,14.8 10.03,13.86 10.6,13.86 12.58,13.86 15.06,11.39 15.06,3.29 16.69,1.66 19.65,1.66 27.51,1.66 28.74,2.89 28.74,10.12 26.15,12.71 v26.15,19.12
  Bottom 1.27: U$2.3 v4.32,18.26
COM_BLUE  (via drill 0.35)
  Top 0.254: U4.PB4 50.29,56.51 50.37,56.59 50.37,60.76 49.2,61.93 48.9,61.93 v48.65,62.18 | v59.02,59.83 59.57,59.28 81.73,59.28 86.97,64.52 R108.2
  Bottom 0.254: v48.65,62.18 48.65,61.35 50.73,59.28 58.47,59.28 v59.02,59.83
COM_GREEN  (via drill 0.35)
  Top 0.254: U4.PB5 49.79,56.61 49.96,56.78 49.96,60.59 49.03,61.53 47.9,61.53 v47.65,61.78 | v59.05,58.87 81.9,58.87 84.75,61.72 R107.2
  Bottom 0.254: v47.65,61.78 50.56,58.87 v59.05,58.87
COM_RED  (via drill 0.35)
  Top 0.254: U4.PB3 50.79,56.5 50.88,56.6 50.88,61.12 49.32,62.68 v49.32,62.79 | v58.34,60.58 59.69,60.58 60.59,59.68 81.56,59.68 89.19,67.31 R106.2
  Bottom 0.254: v49.32,62.79 49.32,61.25 50.89,59.68 57.44,59.68 v58.34,60.58
ENGINE_BURNOUT1  (via drill 0.35)
  Top 1.27: v32.29,86.32 J1.4
  Bottom 0.254: v32.29,86.32 32.29,84.08 T3.C
  Bottom 1.27: J1.4 v32.29,86.32
ENGINE_BURNOUT2  (via drill 0.35)
  Top 0.254: v23.65,84.12 33.65,84.12 34.83,85.3 v34.83,86.32
  Top 1.27: v34.83,86.32 J1.2
  Bottom 0.254: R38.1 23.38,83.85 v23.65,84.12
  Bottom 1.27: v34.83,86.32 J1.2
FLASH_CS  (via drill 0.35)
  Top 0.254: U4.PC6 59.48,48.29 v59.5,48.27 63.59,48.27 63.86,48 v64.28,48 | v60.12,19.12 60.05,19.05 R36.2 | U12.13 66.03,79.35 65.11,78.43 65.11,74.38 65.47,74.02 65.47,73.51 v66.15,72.82
  Bottom 0.254: v59.5,48.27 59.54,48.23 59.54,46.34 60.37,45.51 60.37,19.37 v60.12,19.12 | v66.15,72.82 65.37,72.04 65.37,51.61 64.02,50.27 64.02,48.25 v64.28,48
FLASH_MISO  (via drill 0.35)
  Top 0.254: U4.PB14 58.72,47.29 v58.88,47.45 59.95,47.45 60.33,47.83 60.87,47.83 61.25,47.45 63.54,47.45 v63.87,47.12 | v59.71,21 55.55,21 R35.2 | U12.14 65.95,78.7 65.51,78.26 65.51,74.66 v66.38,73.8
  Bottom 0.254: v58.88,47.45 58.88,46.42 59.96,45.34 59.96,21.25 v59.71,21 | v66.38,73.8 66.2,73.62 65.65,73.62 64.96,72.93 64.96,51.78 63.62,50.44 63.62,47.37 v63.87,47.12
FLASH_MOSI  (via drill 0.35)
  Top 0.254: v59.15,23.12 40.15,23.12 37.65,20.62 37.65,18.62 38.49,17.78 R34.2 | U4.PB15 55.14,47.79 54.91,47.55 54.91,46.02 55.08,45.85 58.42,45.85 v58.65,45.62 v63.46,45.62 | U12.11 68.4,80.62 66.15,80.62 64.15,78.62 v64.15,72.87
  Bottom 0.254: v58.65,45.62 59.11,45.62 59.55,45.17 59.55,23.52 v59.15,23.12 | v64.15,72.87 64.15,71.74 64.56,71.34 64.56,51.95 63.21,50.61 63.21,45.87 v63.46,45.62
FLASH_RESET  (via drill 0.35)
  Top 0.254: U4.PC8 58.98,49.29 59.31,48.96 60.42,48.96 60.43,48.97 60.45,48.97 61,48.97 v61.15,49.12 | v60.52,15.01 57.81,15.01 56.77,13.97 R37.1
  Bottom 0.254: v61.15,49.12 61.15,48.65 59.94,47.44 59.94,46.51 60.77,45.68 60.77,15.26 v60.52,15.01
FLASH_SCK  (via drill 0.35)
  Top 0.254: v58.52,23.78 58.27,23.53 39.98,23.53 37.24,20.79 37.24,18.45 37.65,18.05 37.65,16.11 R33.2 | U4.PC7 55.14,48.79 54.5,48.15 54.5,45.85 54.92,45.44 57.54,45.44 v57.79,45.19 58.37,44.62 v63.06,44.62 | U12.12 66.11,80 64.69,78.58 64.69,73.87 v64.81,73.75
  Bottom 0.254: v57.79,45.19 58.08,45.19 59.15,44.12 59.15,24.12 58.8,23.78 v58.52,23.78 | v64.81,73.75 64.59,73.53 63.88,73.53 63.49,73.14 63.49,71.83 64.15,71.17 64.15,52.12 62.8,50.77 62.8,44.87 v63.06,44.62
GND  (via drill 0.35)
  Top 0.152: U4.VSS_3
  Top 0.254: C52.2 31.15,32.41 | v33.15,28.12 32.65,27.62 31.52,27.62 U11.18 | C71.2 73.73,72.92 74.97,71.68 84.63,71.68 84.99,72.04 v84.99,73.12
  Top 1.27: v24.67,95.46 J1.9 | U$2.5 v4.32,20.8 | U$2.13 v4.32,30.96 | v4.32,64.03 U$4.18 | U$4.20 v4.32,61.49 | v13.46,64.03 U$3.18 | U$3.20 v13.46,61.49
  Bottom 0.254: v84.99,73.12 85.03,73.16 v86.72,73.16
  Bottom 1.27: J1.9 v24.67,95.46 | v4.32,20.8 U$2.5 | v4.32,30.96 U$2.13 | U$4.18 v4.32,64.03 | v4.32,61.49 U$4.20 | 10.67,61.49 U$3.20 v13.46,61.49 | v13.46,64.03 U$3.18
  other vias: 47.15,25.62 44.15,25.62 44.15,31.12 47.15,31.12 52.65,34.12 52.65,25.62 35.15,28.12 33.15,31.12 35.15,31.12 37.65,28.12 37.46,29.85 28.39,31.34 26.39,30.84 26.39,27.84 35.16,25.75 21.48,33.02 16.48,33.02 16.33,27.97 16.33,25.97 22.83,20.97 18.33,20.97 15.33,22.47 15.33,16.97 18.33,9.97 18.33,5.97 21.83,5.97 29.83,4.97 33.83,5.97 40.33,5.97 47.83,5.97 56.33,5.97 53.33,16.97 55.83,16.47 39.83,20.47 33.33,21.97 45.33,21.97 39.33,11.47 57.33,11.97 57.33,19.97 71.33,7.47 71.33,11.97 71.33,15.97 71.33,19.97 71.33,24.97 78.83,7.47 85.83,9.97 81.33,23.97 81.33,15.97 89.83,20.97 84.83,26.97 92.83,26.97 92.83,32.47 84.83,32.97 92.83,37.47 84.83,39.47 56.33,38.47 54.33,42.97 51.83,45.97 53.83,49.97 48.83,48.47 49.83,52.47 45.83,48.97 41.33,36.47 41.33,39.97 43.83,43.97 43.83,36.47 43.83,39.97 46.83,39.97 37.83,47.97 35.83,53.97 37.33,55.47 42.22,59.16 43.72,59.16 45.72,57.16 60.22,56.66 62.72,56.66 67.22,47.66 67.22,43.16 67.22,38.16 64.72,32.16 71.22,32.16 76.72,32.16 76.22,38.16 76.22,42.66 71.22,52.66 71.22,55.16 80.72,58.16 86.22,59.66 87.22,63.16 75.22,55.16 85.72,65.66 85.72,68.16 86.72,68.16 89.22,66.16 92.72,66.16 94.72,61.66 94.72,53.66 94.72,47.16 94.72,41.16 89.22,73.16 85.72,79.16 92.22,79.16 88.72,84.16 86.22,89.16 86.22,96.66 78.72,94.16 63.22,94.16 61.72,87.66 46.72,89.66 37.72,96.16 39.22,93.16 25.87,87.96 20.22,90.66 20.22,95.16 20.22,86.16 24.72,81.16 38.22,86.66 19.22,78.66 32.22,72.16 33.22,69.16 19.72,62.16 15.72,62.16 15.72,73.16 15.72,87.16 13.22,96.16 3.22,68.16 3.22,72.66 3.22,83.16 31.72,62.16 26.22,66.16 29.22,69.16 47.06,59.98 43.63,62.27 38.22,73.16 42.22,73.16 45.72,75.66 38.72,79.66 35.22,82.16 44.22,82.16 47.72,82.16 42.72,85.16 25.97,96.21
  pour Top: -1.35,39.12 20.65,39.12 24.15,35.62 39.15,35.62 39.15,44.12 35.15,48.12 35.15,54.12 43.59,62.56 59.88,62.56 63.84,58.61 80.15,58.61 80.15,82.12 75.65,86.62 60.15,86.62 58.15,88.62 48.65,88.62 48.65,75.62 33.15,60.12 0.15,60.12 -3.85,64.12 -3.85,95.12 7.15,106.12 98.65,106.12 110.65,94.12 110.65,-3.38 103.65,-10.38 0.15,-10.38 -8.35,-1.88 -8.35,32.12
  pour Bottom: -1.35,39.12 20.65,39.12 24.15,35.62 39.15,35.62 39.15,44.12 35.15,48.12 35.15,54.12 43.59,62.56 59.88,62.56 63.84,58.61 80.15,58.61 80.15,82.12 75.65,86.62 60.15,86.62 58.15,88.62 48.65,88.62 48.65,75.62 33.15,60.12 0.15,60.12 -3.85,64.12 -3.85,95.12 7.15,106.12 98.65,106.12 110.65,94.12 110.65,-3.38 103.65,-10.38 0.15,-10.38 -8.35,-1.88 -8.35,32.12
GNDA  (via drill 0.35)
  Top 0.762: U$1.11 v13.46,28.42
  Bottom 0.762: v11.15,43.12 9.15,41.12 9.15,29.62 10.35,28.42 U$1.11 v13.46,28.42
  other vias: 3.65,44.62 3.65,50.62 3.65,56.12 18.65,58.12 15.65,45.62 21.15,41.62 22.65,45.12 26.15,45.12 26.15,39.62 31.65,39.62 34.15,39.62 29.65,39.62 36.65,39.62 28.65,46.62 33.78,49.28 33.53,51.21 33.79,54.57 38.12,59.13 37.05,61.86 28.55,56.36 23.05,55.86 22.55,58.86 18.93,56 10.65,56.62
  pour Top: -2.35,59.62 33.65,59.62 36.65,62.62 39.65,62.62 40.15,62.12 40.15,60.12 34.65,54.62 34.65,47.12 38.15,43.62 38.15,36.62 25.15,36.62 21.65,40.12 -2.35,40.12
  pour Bottom: -2.35,59.62 33.65,59.62 36.65,62.62 39.65,62.62 40.15,62.12 40.15,60.12 34.65,54.62 34.65,47.12 38.15,43.62 38.15,36.62 25.15,36.62 21.65,40.12 -2.35,40.12
IND_LED  (via drill 0.35)
  Top 0.254: v51.56,37.6 51.56,37.95 51.71,38.11 51.71,39.06 51.17,39.6 51.17,42.56 51.79,43.18 U4.PB2 | v53.15,37.62 53.15,36.62 53.74,36.03 86.56,36.03 89.07,38.54 R7.1
  Bottom 0.254: v51.56,37.6 53.13,37.6 v53.15,37.62
LED_GREEN  (via drill 0.35)
  Top 0.254: U4.PC9 59.06,49.79 59.23,49.62 v60.15,49.62 | v62.15,71.12 62.35,71.12 62.75,71.52 63.29,71.52 63.55,71.27 84.8,71.27 85.65,72.12 85.65,75.12 86.98,76.45 R6.2
  Bottom 0.254: v60.15,49.62 60.15,50.12 60.93,50.9 60.93,69.47 62.15,70.7 v62.15,71.12
LED_RED  (via drill 0.35)
  Top 0.254: U4.PA8 57.09,50.29 57.27,50.47 61.08,50.47 v61.34,50.22 | R4.2 86.78,70.87 v63.02,70.87
  Bottom 0.254: v61.34,50.22 61.34,69.18 v63.02,70.87
LINE4  (via drill 0.35)
  Top 1.27: v13.46,20.8 U$2.6
  Bottom 1.27: U$2.6 v13.46,20.8
LINE5  (via drill 0.35)
  Top 1.27: U$2.8 v13.46,23.34
  Bottom 1.27: v13.46,23.34 U$2.8
LOOP_LED
  Top 0.254: U4.PB10 52.29,43.11 51.58,42.4 51.58,39.77 52.12,39.23 52.12,38.35 52.32,38.15 52.32,36.45 53.15,35.62 89.01,35.62 R3.1
MAX_DRDY  (via drill 0.35)
  Top 0.254: U12.18 70.77,76.24 69.15,74.62 v67.65,74.62 | U4.PA0 43.32,47.29 42.15,46.12 v42.15,39.28 | v42.15,32.34 42.4,32.59 62.94,32.59 v63.06,32.47
  Bottom 0.254: v67.65,74.62 67.59,74.62 67.17,74.2 67.17,72.91 65.78,71.52 65.78,51.45 64.43,50.1 64.43,48.77 64.93,48.27 64.93,45.4 62.8,43.27 62.8,32.72 v63.06,32.47 | v42.15,39.28 v42.15,32.34
MAX_FORCE+  (via drill 0.35)
  Top 0.254: U12.6 72.07,82.34 72.5,82.77 73.05,82.77 73.35,83.07 73.35,84.12 | 73.35,84.12 73.35,84.77 72.7,85.42 63.6,85.42 62,83.82 45.95,83.82 39.65,90.12 30.65,90.12 29.75,89.22 J1.6 | U12.5 73.14,80.62 74.15,80.62 74.65,81.12 74.65,82.82 73.35,84.12
  Top 1.27: v29.75,86.32 J1.6
  Bottom 1.27: v29.75,86.32 J1.6
MAX_RTDIN+  (via drill 0.35)
  Top 0.254: U12.7 71.42,82.59 C73.1 70.92,85.01 65.04,85.01 v64.65,84.62 | v63.65,89.12 63.15,89.62 62.23,89.62 60.82,91.03 41.04,91.03 40.32,91.75 36.58,91.75 34.85,93.48
  Top 1.27: v34.85,95.32 34.85,93.48 J1.1
  Bottom 0.254: v64.65,84.62 63.65,85.62 v63.65,89.12
  Bottom 1.27: J1.1 34.83,95.3 v34.85,95.32
MAX_RTDIN-  (via drill 0.35)
  Top 0.254: U12.8 70.77,83.46 C73.2 | U12.9 70.15,81.72 70.15,82.62 70.68,83.15 C73.2 | C73.2 69.62,84.61 65.57,84.61 64.92,83.96 63.99,83.96 v63.65,83.62 | J1.3 32.29,92.63 32.98,91.95 33.21,91.71 33.58,91.34 40.16,91.34 40.87,90.62 60.65,90.62 v62.65,88.62
  Top 1.27: J1.3 v32.29,95.36 v32.3,95.37
  Bottom 0.254: v63.65,83.62 63.65,85.05 63.24,85.45 63.24,88.03 v62.65,88.62
  Bottom 1.27: v32.3,95.37 v32.29,95.36 J1.3
MPU_CS
  Top 0.254: U4.PC4 49.79,43.49 49.51,43.21 49.51,35.75 47.16,33.4 39.65,33.4 38.65,32.4 38.65,29.62 38.15,29.12 36.23,29.12 35.95,29.4 32.65,29.4 32.64,29.41 U11.22
MPU_INT
  Top 0.254: U4.PC5 50.29,43.42 49.91,43.04 49.91,35.59 47.32,32.99 39.82,32.99 39.06,32.23 39.06,27.03 38.62,26.59 28.68,26.59 28.06,27.21 28.06,28.12 28.15,28.21 28.56,28.21 U11.12
MS56_CS  (via drill 0.35)
  Top 0.254: U4.PA4 47.79,43.48 47.88,43.39 47.88,36.43 46.48,35.03 18.02,35.03 v17.77,35.28 | U$31.P$4 U$31.P$5 18.18,31.09 v17.64,31.62
  Bottom 0.254: v17.77,35.28 17.64,35.15 v17.64,31.62
N$1
  Top 0.254: R1.2 3V3.A
N$2
  Top 0.254: R3.2 LOOP.A
N$3
  Top 0.254: R2.2 5V.A
N$4
  Top 0.254: R4.1 90.93,70.61 LED1.3
N$5
  Top 0.254: U4.BOOT0 48.29,57.81 R5.2
N$6
  Top 0.254: R6.1 91.19,76.45 LED1.1
N$7  (via drill 0.35)
  other vias: 50,50
N$8
  Top 0.254: R7.2 IND.A
N$9
  Top 0.254: S1.1 93.56,16.12 | 93.56,16.12 S1.4 | 93.56,16.12 93.39,16.29 C13.1 89.41,15.94 U$6.5
N$10  (via drill 0.35)
  Top 0.254: U$6.6 79.8,17.12 v77.15,17.12 | v78.15,57.12 78.58,57.12 78.74,57.29 86.65,57.29 88.55,59.19 R8.2
  Bottom 0.254: v77.15,17.12 77.15,18.12 77.93,18.9 77.93,49.26 77.24,49.95 77.24,56.21 v78.15,57.12
N$11
  Top 0.254: R8.1 LED3.A
N$12  (via drill 0.35)
  Top 0.254: U$6.15 77.91,17.94 v78.09,18.12 | v78.15,56.12 78.91,56.88 R9.1
  Bottom 0.254: v78.09,18.12 78.34,18.37 78.34,49.43 77.65,50.12 77.65,55.62 v78.15,56.12
N$13
  Top 0.254: R9.2 LED4.A
N$14
  Top 0.254: U6.1 56.78,75.56 55.03,77.31 C16.1 53.76,82.55 R11.2 53.34,81.7 C17.2
N$15
  Top 0.254: U6.4 58.84,79.87 58.84,81.12 | 58.84,81.12 C18.1 | C16.2 58,82.55 R10.2 58.42,81.54 58.84,81.12
N$16
  Top 0.254: U6.7 54.93,76.84 57.15,74.62 57.65,74.62 58.38,73.89 R13.1
N$17
  Top 0.254: U6.3 60.65,78.11 R14.1
N$18
  Top 0.254: U6.2 60.65,76.84 R14.2
N$21
  Top 0.254: U12.1 75.08,78.05 R61.2 75.37,77.9 74.65,78.62 73.19,78.62 U12.2
N$22
  Top 0.254: 75.23,79.54 75.05,79.35 U12.3 | 75.23,79.54 R61.1 | U12.4 74.77,80 75.23,79.54
N$24
  Bottom 0.254: R26.1 85.65,50.72 85.65,49.96 R25.1 86.56,47.33 T2.B
N$25
  Bottom 0.254: C14.1 74.57,70.55 R16.2 74.99,69.7 C15.2 74.81,69.28 73.15,67.62 73.15,65.62 71.09,63.56 U5.1
N$26
  Bottom 0.254: C14.2 70.08,70.55 R12.2 69.91,69.7 C29.1 69.49,67.87 U5.4
N$27
  Bottom 0.254: R18.1 73.25,64.84 U5.7
N$28
  Bottom 0.254: U5.3 67.69,66.11 R20.1
N$29
  Bottom 0.254: U5.2 67.69,64.84 R20.2
N$30
  Bottom 0.254: U10.1 54.59,75.56 55.15,76.12 55.15,79.34 55.48,79.67 55.48,81.4 C50.1 | C50.1 56.61,82.85 R30.2 | C54.2 C50.1
N$31
  Bottom 0.254: T2.C 90.06,45.03 92.21,47.18 BUZ2.+
N$32
  Bottom 0.254: R26.2 84.99,53.58 T1.C
N$33
  Bottom 0.254: R27.1 89.7,51.38 T1.B
N$34
  Bottom 0.254: C55.1 C50.2 | C50.2 55.15,82.77 R29.2 | C50.2 55.07,79.84 54.61,79.38 U10.4
N$35
  Top 0.254: C51.1 28.12,25.65 27.65,26.12 27.65,28.62 28.03,29 U11.10
N$36
  Bottom 0.254: U10.7 55.87,76.84 55.56,76.53 55.56,75.95 53.38,73.77 R31.1
N$37
  Bottom 0.254: U10.3 51.12,78.11 R32.1
N$38
  Bottom 0.254: U10.2 51.12,76.84 R32.2
N$39
  Top 0.254: R33.1 40.22,12.55 40.7,12.07 U$39.16
N$40
  Top 0.254: R34.1 40.22,16.68 41,15.91 41,13.48 41.15,13.34 U$39.15
N$41
  Top 0.254: U$39.8 53.62,20.96 R35.1
N$42
  Top 0.254: U$39.7 53.12,19.68 R36.1
N$43
  Top 0.254: U$39.3 53.12,14.61 R37.2
N$44
  Bottom 0.254: T3.B 33.33,79.78 R28.1
N$45
  Bottom 0.254: R40.1 20.54,80.61 21.65,80.61 | 21.65,80.61 R39.1 | R38.2 21.72,80.68 21.65,80.61
N$46
  Top 0.254: R46.1 27.7,48.17 22.34,48.17 21.85,48.66 VNQ5027AK-E1.P$4
N$47
  Top 0.254: R47.1 27.73,50.12 25.15,50.12 25.14,50.13 22.19,50.13 22.06,50.26 VNQ5027AK-E1.P$6
N$48
  Top 0.254: VNQ5027AK-E1.P$8 27.53,51.86 R48.1
N$49
  Top 0.254: R49.1 25.55,54.02 25.13,53.6 22.19,53.6 22.05,53.46 VNQ5027AK-E1.P$10
N$50
  Top 0.254: R41.2 22.15,47.34 21.63,47.86 VNQ5027AK-E1.P$3
N$51
  Top 0.254: R42.2 22.74,49.21 22.5,49.46 VNQ5027AK-E1.P$5
N$52
  Top 0.254: VNQ5027AK-E1.P$7 22.71,51.06 R43.2
N$53
  Top 0.254: VNQ5027AK-E1.P$9 22.7,52.66 R44.2
N$54
  Top 0.254: VNQ5027AK-E1.P$11 22.49,54.26 R45.2
N$55
  Top 0.508: VNQ5027AK-E1.P$2 21.47,47.06 22.14,46.38 23.65,46.38 | 23.65,46.38 26.89,46.38 27.82,45.45 D1.A | 23.65,46.38 25.47,44.56 R54.2
N$56  (via drill 0.35)
  Top 0.254: U4.PB0 50.79,43.34 50.36,42.91 50.36,38.91 v50.65,38.62 | v46.65,38.62 19.24,38.62 R55.2
  Bottom 0.254: v50.65,38.62 v46.65,38.62
N$57  (via drill 0.35)
  Top 0.254: U4.PB1 51.29,43.26 50.76,42.73 50.76,39.62 50.76,39.44 51.31,38.89 51.31,38.28 v50.65,37.62 | v46.65,37.62 46.15,37.62 45.56,38.21 20.74,38.21 18.86,36.33 R56.2
  Bottom 0.254: v50.65,37.62 v46.65,37.62
N$102
  Top 0.254: R106.1 93.22,67.31 93.85,66.67 93.85,64.96 D2.2
N$103
  Top 0.254: R107.1 93.25,61.72 93.83,62.3 D2.3
N$104
  Top 0.254: R108.1 90.75,64.52 91.18,64.09 D2.4
NRST  (via drill 0.35)
  Top 0.254: U4.NRST 45.32,50.79 v45.65,51.12 | v55.69,54.78 55.44,55.03 55.44,57.13 55.32,57.25 55.32,60.42 57.28,62.37 57.28,65.75 58.02,66.49 80.18,66.49 82.03,68.35 82.03,68.37 v82.29,68.62 | U$5.5 70.74,87.53 71.65,86.62 73.58,86.62 73.98,86.21 79.06,86.21 79.65,85.62 v82.03,85.62 95.13,85.62 C25.1 96.12,84.68 S2.1 S2.4
  Bottom 0.254: v45.65,51.12 45.65,53.12 47.15,54.62 55.53,54.62 v55.69,54.78 | v82.29,68.62 82.03,68.87 82.03,68.89 81.78,69.14 81.78,85.37 v82.03,85.62
POWER_CS
  Top 0.254: R45.1 26.91,54.58 27.17,54.85 30.11,54.85 30.53,54.43 32.76,54.43 34.36,52.83 41.86,52.83 42.32,53.29 U4.PC13
POWER_INPUT1  (via drill 0.35)
  Top 0.254: R41.1 26.48,47.34 v26.65,47.51 | v27.62,57.78 29.74,59.9 45.4,59.9 46.24,59.05 46.24,57.83 47.29,56.78 U4.PB9
  Bottom 0.254: v26.65,47.51 27.37,48.23 27.37,57.53 v27.62,57.78
POWER_INPUT2  (via drill 0.35)
  Top 0.254: R42.1 25.84,49.15 v26.15,49.46 | v27.35,58.75 27.35,59.01 28.65,60.31 45.63,60.31 46.65,59.29 46.65,58 47.79,56.86 U4.PB8
  Bottom 0.254: v26.15,49.46 26.96,50.27 26.96,58.36 v27.35,58.75
POWER_INPUT3  (via drill 0.35)
  Top 0.254: R43.1 25.49,50.96 v25.65,51.12 | v26.9,59.59 27.02,59.59 28.15,60.71 48.69,60.71 49.15,60.26 49.15,57.12 48.79,56.76 U4.PB7
  Bottom 0.254: v25.65,51.12 26.56,52.03 26.56,59.24 v26.9,59.59
POWER_INPUT4  (via drill 0.35)
  Top 0.254: R44.1 25.3,52.77 v25.65,53.12 | v26.15,60.12 27.15,61.12 48.86,61.12 49.56,60.43 49.56,56.95 49.29,56.68 U4.PB6
  Bottom 0.254: v25.65,53.12 26.15,53.62 v26.15,60.12
POWER_OUTPUT1
  Top 0.508: VNQ5027AK-E1.P$13 13.03,44.53 C61.1
  Top 0.762: VNQ5027AK-E1.P$15 9.14,47.86 8.34,47.06 | 8.34,47.06 J7.1 | VNQ5027AK-E1.P$14 9.15,47.06 | 9.15,47.06 8.34,47.06 | VNQ5027AK-E1.P$13 9.95,46.26 9.15,47.06
POWER_OUTPUT2  (via drill 0.35)
  Top 0.508: C62.1 15.03,43.46 12.46,46.04 12.46,48.5 12.3,48.66 VNQ5027AK-E1.P$16 VNQ5027AK-E1.P$17 VNQ5027AK-E1.P$18
  Top 0.762: VNQ5027AK-E1.P$17 2.49,49.46 v1.65,48.62 | v1.65,28.12 2.65,27.12 8.65,27.12 9.89,25.88 U$1.9 v13.46,25.88
  Bottom 0.762: v1.65,48.62 v1.65,28.12 | v13.46,25.88 U$1.9
POWER_OUTPUT3
  Top 0.508: C63.1 16.95,43.32 16.15,44.12 15.31,44.12 13.21,46.22 13.21,50.06 12.21,51.06 VNQ5027AK-E1.P$19 VNQ5027AK-E1.P$20 VNQ5027AK-E1.P$21
POWER_OUTPUT4  (via drill 0.35)
  Top 0.508: VNQ5027AK-E1.P$22 12.49,53.46 v12.65,53.62
  Top 0.762: VNQ5027AK-E1.P$24 9.09,55.06 | 9.09,55.06 J6.1 | VNQ5027AK-E1.P$23 9.89,54.26 | 9.89,54.26 9.09,55.06 | VNQ5027AK-E1.P$22 10.69,53.46 9.89,54.26
  Bottom 0.508: v12.65,53.62 12.65,55.12 13.37,55.84 C64.1
PRESSURE1  (via drill 0.35)
  Top 0.254: v51.15,71.96 51.31,72.12 v58.76,72.12 | v50.65,69.45 50.32,69.11 U9.16 | v59.86,62.03 60.12,61.78 60.42,61.78 61.7,60.5 68.68,60.5 v68.94,60.75
  Bottom 0.254: C30.1 R18.2 | R18.2 | v51.15,71.96 50.65,71.46 v50.65,69.45 | v58.76,72.12 58.76,70.01 60.12,68.65 60.12,62.28 v59.86,62.03 | v68.94,60.75 69.29,60.75 69.33,60.7 70.82,60.7 R18.2
PRESSURE2  (via drill 0.35)
  Top 0.254: U9.19 48.97,66.8 v48.65,67.12 | R13.2 C32.1 54.04,72.62 v48.65,72.62
  Bottom 0.254: v48.65,67.12 48.2,67.58 48.2,72.17 v48.65,72.62
PRESSURE_IN1+  (via drill 0.35)
  Top 0.254: J2.6 29.75,91.52 30.34,90.93 39.99,90.93 44.39,86.53 55.87,86.53 56.27,86.12 v68.15,86.12
  Top 1.27: v29.75,95.46 J2.6
  Bottom 0.254: R12.1 70.93,72.42 R21.1 70.18,73.09 68.15,75.12 v68.15,86.12
  Bottom 1.27: v29.75,95.46 J2.6
PRESSURE_IN2+  (via drill 0.35)
  Top 0.254: R10.1 57.15,84.67 R15.1 55.7,86.12 44.23,86.12 39.82,90.53 28.06,90.53 27.15,89.62 27.21,89.56 27.21,87.62
  Top 1.27: v27.21,86.32 27.21,87.62 J1.8
  Bottom 1.27: v27.21,86.32 J1.8
PRESSURE_VCC  (via drill 0.35)
  Top 0.508: IC1.3 42.55,76.52 C36.1 | C36.1 C37.1 | C36.1 43.21,79.06 43.18,79.06 42.15,80.09 42.15,83.12 40.65,84.62 34.9,84.62 33.06,82.78 23.15,82.78 21.15,84.78 21.15,91.12 21.65,91.62 23.65,91.62 23.9,91.37 | J1.10 24.67,90.6 23.9,91.37 | 23.9,91.37 26.45,91.37 27.21,92.13 J1.7
  Top 1.27: v27.21,95.46 J1.7 | v24.67,86.32 J1.10
  Bottom 1.27: J1.10 v24.67,86.32 | v27.21,95.46 J1.7
PWM1  (via drill 0.35)
  Top 0.254: v13.46,38.58 14.02,39.14 R55.1
  Top 1.27: U$2.20 v13.46,38.58
  Bottom 1.27: v13.46,38.58 U$2.20
PWM2  (via drill 0.35)
  Top 0.254: v13.46,36.04 13.75,36.33 R56.1
  Top 1.27: v13.46,36.04 U$2.18
  Bottom 1.27: U$2.18 v13.46,36.04
PWM3  (via drill 0.35)
  Top 1.27: v13.46,33.5 U$2.16
  Bottom 1.27: U$2.16 v13.46,33.5
PWM4  (via drill 0.35)
  Top 1.27: U$2.14 v13.46,30.96
  Bottom 1.27: v13.46,30.96 U$2.14
R_MISO  (via drill 0.35)  (1 unrouted)
  Bottom 1.27: U$2.7 v4.32,23.34
R_MOSI  (1 unrouted)
R_SCK  (1 unrouted)
SENSOR_MISO  (via drill 0.35)
  Top 0.254: U4.PA6 48.79,43.64 48.69,43.55 48.69,36.09 46.82,34.21 15.82,34.21 15.06,33.45 15.06,30.37 v15.31,30.12 15.06,29.87 15.06,28.14 15.31,27.89 15.31,27.35 15.06,27.1 15.06,25.79 15.82,25.03 26.81,25.03 27.15,25.36 27.15,29.05 27.51,29.41 U11.9 | v17.64,29.62 17.94,29.62 18.16,29.85 18.17,29.84 U$31.P$6
  Bottom 0.254: v15.31,30.12 15.81,29.62 v17.64,29.62
SENSOR_MOSI
  Top 0.254: U4.PA7 49.29,43.57 49.1,43.38 49.1,35.92 46.99,33.81 39.48,33.81 | 39.48,33.81 16,33.81 15.46,33.27 15.46,30.89 16.15,30.21 16.15,29.12 16.69,28.59 U$31.P$7 | 39.48,33.81 38.24,32.57 38.24,31.12 37.74,30.62 36.15,30.62 35.75,30.22 32.65,30.22 32.64,30.21 U11.24
SENSOR_SCLK  (via drill 0.35)
  Top 0.254: U4.PA5 48.29,36.26 46.65,34.62 15.65,34.62 14.65,33.62 v14.65,27.62 14.65,25.62 15.65,24.62 36.15,24.62 v36.65,25.12 | v17.64,27.12 18.23,27.12 18.41,27.3 19.19,27.3 U$31.P$8 | U11.23 v36.46,29.81 v36.46,29.82
  Bottom 0.254: v14.65,27.62 15.15,27.12 v17.64,27.12 | v36.65,25.12 36.65,29.63 v36.46,29.82
SERVO_RECO1  (via drill 0.35)
  Top 1.27: v4.32,69.11 U$4.14
  Bottom 1.27: U$4.14 v4.32,69.11
SERVO_RECO2  (via drill 0.35)
  Top 1.27: U$4.12 v4.32,71.65
  Bottom 1.27: v4.32,71.65 U$4.12
STLINK_RX  (via drill 0.35)
  Top 0.254: U4.PA3 46.29,45.06 v46.65,45.42 | v47.81,52.99 48.53,53.71 53.43,53.71 54.62,54.9 54.62,56.8 54.51,56.91 54.51,60.75 56.46,62.71 56.46,67.12 56.65,67.31 79.18,67.31 80.22,68.35 80.22,68.37 v80.47,68.62 | v80.65,91.12 68.15,91.12 66.93,92.34 U$5.8
  Bottom 0.254: v46.65,45.42 47.56,46.32 47.56,52.74 v47.81,52.99 | v80.47,68.62 80.72,68.87 80.72,68.89 80.97,69.14 80.97,90.8 v80.65,91.12
STLINK_TX  (via drill 0.35)
  Top 0.254: U4.PA2 45.82,46.29 v46.15,46.62 | v47.15,53.62 47.65,54.12 53.27,54.12 54.22,55.07 54.22,56.63 54.1,56.74 54.1,60.92 56.06,62.88 56.06,67.45 56.32,67.71 78.67,67.71 79.31,68.35 79.31,68.37 v79.56,68.62 | v80.02,90.46 79.77,90.71 69.24,90.71 68.2,89.67 U$5.7
  Bottom 0.254: v46.15,46.62 47.15,47.62 v47.15,53.62 | v79.56,68.62 79.81,68.87 79.81,68.89 80.56,69.65 80.56,89.92 v80.02,90.46
SUPPLY  (via drill 0.35)
  Top 0.254: 15.65,49.12 15.65,50.39 VNQ5027AK-E1.P$25 15.87,50.12 15.87,48.9 16.65,48.12
  Top 0.508: C60.1 20.89,45.77 VNQ5027AK-E1.P$1 18.51,46.26 v17.15,47.62 16.65,48.12 15.65,49.12 15.87,49.34 15.87,50.12 | VNQ5027AK-E1.P$12 20.89,55.55 C59.1 | U$3.7 U$3.9 | v12.15,87.12 13.88,85.4 13.89,85.4 14.5,84.79 14.5,84.77 17.15,82.12 27.65,82.12 29.15,80.62 29.15,79.62 30.65,78.12 C35.1 C34.1 35.25,76.52 IC1.1
  Top 1.27: U$3.7 v4.32,76.73 | v4.32,74.19 U$3.9 | C59.1 19.05,59.62 13.65,59.62 v2.65,59.62
  Top 1.397: 13.65,59.62 15.87,57.4 VNQ5027AK-E1.P$25
  Bottom 0.254: R25.2 88.26,47.33 T2.E | v16.1,48.62 v16.1,50.62 17.15,49.57 v17.15,47.62
  Bottom 0.762: v4.32,76.73 1.65,79.4 1.65,84.62 4.15,87.12 v12.15,87.12 12.65,87.12 15.15,89.62 15.15,96.12 17.56,98.53 23.15,98.53 | R25.2 90.08,49.05 92.15,51.12 92.15,54.62 91.15,55.62 85.15,55.62 83.94,56.83 83.94,95.12 84.06,95.24 84.06,96 81.53,98.53 23.15,98.53 | 23.15,98.53 23.15,86.12 27.48,81.79 T3.E
  Bottom 1.27: v4.32,74.19 U$3.9 | U$3.7 v4.32,76.73 1.73,74.14 1.73,60.54 v2.65,59.62
  other vias: 14.65,52.62 14.65,50.62 14.65,48.62 17.35,48.62 17.35,50.62 17.35,52.62 16.1,52.57
  pour Bottom: 13.65,54.12 13.65,47.12 18.15,47.12 18.15,54.12
SWCLK  (via drill 0.35)
  Top 0.254: U4.PA14 53.79,56.48 53.69,56.58 53.69,61.09 55.65,63.04 55.65,67.62 56.15,68.12 78.15,68.12 v78.65,68.62 | v79.91,86.62 74.15,86.62 73.28,87.49 U$5.3
  Bottom 0.254: v78.65,68.62 78.9,68.87 78.9,68.89 79.63,69.62 79.96,69.62 80.16,69.81 80.16,86.37 v79.91,86.62
SWDIO  (via drill 0.35)
  Top 0.254: U4.PA13 54.48,52.79 54.15,53.12 54.15,53.85 55.03,54.74 55.03,56.96 54.91,57.08 54.91,60.59 56.87,62.54 56.87,66.34 57.43,66.9 79.68,66.9 81.12,68.35 81.12,68.37 v81.38,68.62 | v81.15,95.62 73.15,95.62 72.01,94.48 U$5.4
  Bottom 0.254: v81.38,68.62 81.38,95.39 v81.15,95.62
TENSO  (via drill 0.35)
  Top 0.254: U9.9 53.82,69.12 v54.15,69.45
  Bottom 0.254: C56.1 R31.2 55.08,70.38 v54.15,69.45
TENSO_IN+
  Bottom 0.254: J3.1 55.02,85.94 R29.1
TENSO_IN-
  Bottom 0.254: J3.2 56.61,86.89 R30.1
VBAT  (via drill 0.35)
  Top 0.254: C27.1 41.32,53.79 U4.VBAT 45.98,53.79 46.65,53.12 46.65,51.62 47.15,51.12 52.65,51.12 v53.15,51.62 | v58.29,53.48 64.44,53.48 C48.1 66.12,53.15 v66.65,52.62
  Bottom 0.254: v53.15,51.62 55.01,53.48 57.36,53.48 57.38,53.46 57.92,53.46 57.94,53.48 v58.29,53.48 | v66.65,52.62 66.65,50.12 65.83,49.3 U$32.+
VCAP1
  Top 0.254: U4.VCAP_1 52.79,41.81 C19.1
WATCHDOG  (via drill 0.35)
  Top 1.27: U$4.16 v4.32,66.57
  Bottom 1.27: v4.32,66.57 U$4.16
XBEE_RX  (via drill 0.35)
  Top 0.254: U4.PA10 78.98,51.29 v79.15,51.12 | v79.15,10.62 79.83,9.94 U$6.2
  Bottom 0.254: v79.15,51.12 v79.15,10.62
XBEE_TX  (via drill 0.35)
  Top 0.254: U4.PA9 57.01,50.79 57.1,50.88 78.1,50.88 v78.49,50.49 | v78.49,12.12 78.67,11.94 U$6.3
  Bottom 0.254: v78.49,50.49 78.74,50.24 78.74,12.37 v78.49,12.12

## Text on the board
tPlace: CAN | Bartosz / stworzył / Bolka | Bolek 1.0